# EAGLE design tx (EAGLE 9.2.2)
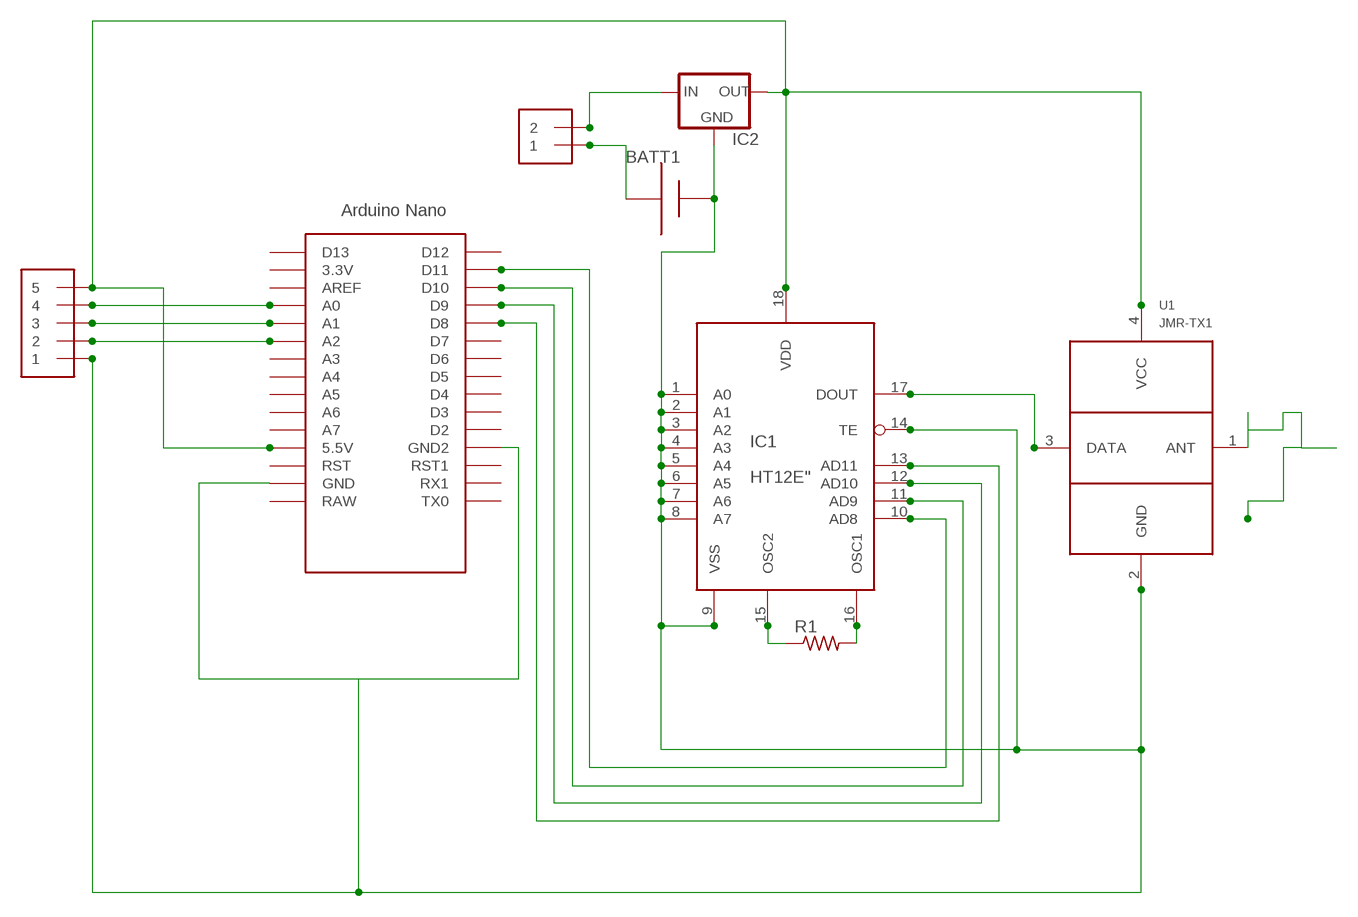
[diagram p0: schematic, sheet 1]

## Parts
BATT1  AAA  [12BH412]
IC1  HT12E"  [18-DIP-A]
IC2  78MXXL  [78MXXL]
J1  1X5  [1X05-3.5MM]
J2  1X2-3.5MM  [1X2-3.5MM]
R1  R-US_0207/9  [0207/9]
U1  JMR-TX1  [JMR-TX1]
U$2  NANO  [NANO]

## Nets
GND: BATT1.+ IC1.1(A0) IC1.2(A1) IC1.3(A2) IC1.4(A3) IC1.5(A4) IC1.6(A5) IC1.7(A6) IC1.8(A7) IC1.9(VSS) IC1.14(TE) IC2.GND J1.1 U1.2(GND) U$2.GND U$2.GND1(GND2)
N$1: IC1.15(OSC2) R1.1
N$2: IC2.IN J2.2
N$3: BATT1.- J2.1
N$4: IC1.16(OSC1) R1.2
N$5: IC1.13(AD11) U$2.D8
N$6: IC1.17(DOUT) U1.3(DATA)
N$7: IC1.12(AD10) U$2.D9
N$8: IC1.11(AD9) U$2.D10
N$9: IC1.10(AD8) U$2.D11
N$10: U1.1(ANT)
N$11: J1.4 U$2.A0
N$12: J1.3 U$2.A1
N$13: J1.2 U$2.A2
VCC: IC1.18(VDD) IC2.OUT J1.5 U1.4(VCC) U$2.5V(5.5V)
Unconnected: U$2.3.3V U$2.A3 U$2.A4 U$2.A5 U$2.A6 U$2.A7 U$2.AREF U$2.D2 U$2.D3 U$2.D4 U$2.D5 U$2.D6 U$2.D7 U$2.D12 U$2.D13 U$2.ICSP1 U$2.ICSP2 U$2.ICSP3 U$2.ICSP4 U$2.ICSP5 U$2.ICSP6 U$2.RAW U$2.RST U$2.RST1 U$2.RX1 U$2.TX0

## Library data of the parts
BATT1 = adafruit:AAA: AAA PC pin holder Mouser part #12BH412 - but pretty much any 1x AAA battery holder should be the same http://www.ladyada.net/library/pcb/eaglelibrary.html
IC1 = holtek:HT12E: transmitter = encoder ic
IC2 = v-reg:78MXXL: VOLTAGE REGULATOR
J1 = adafruit:1X5
J2 = adafruit:1X2: 3.5mm Terminal block http://www.ladyada.net/library/pcb/eaglelibrary.html
R1 = adafruit:R-US_: RESISTOR, American symbol
U1 = JMR_RF_Lib:JMR-TX1
U$2 = Arduino-clone:NANO: Arduino Nano

## Net classes
0 default: width 0.305 mm, drill 0.508 mm, clearance 0.381 mm

## Board
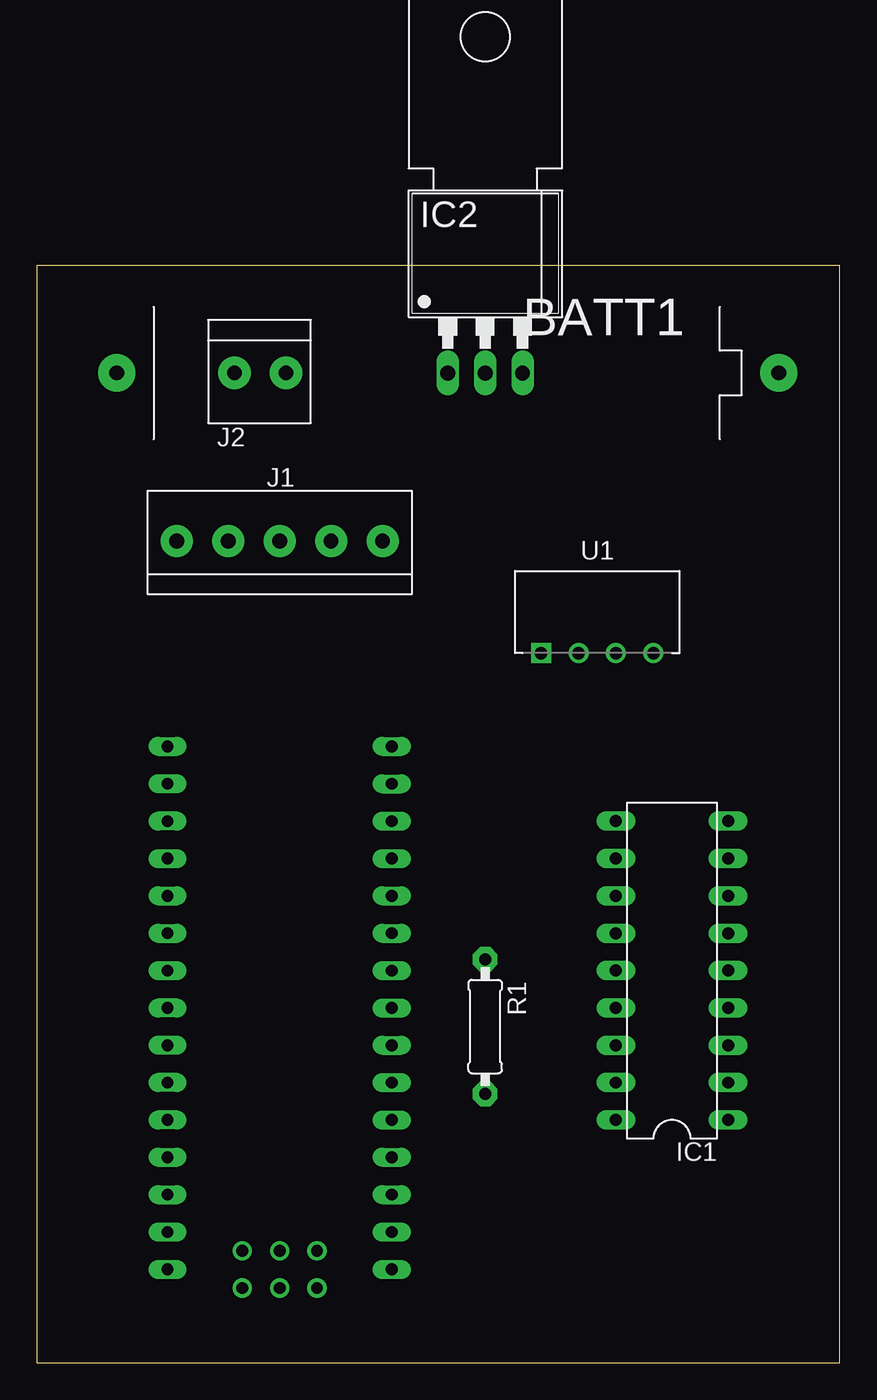
[diagram p1: board, top side]
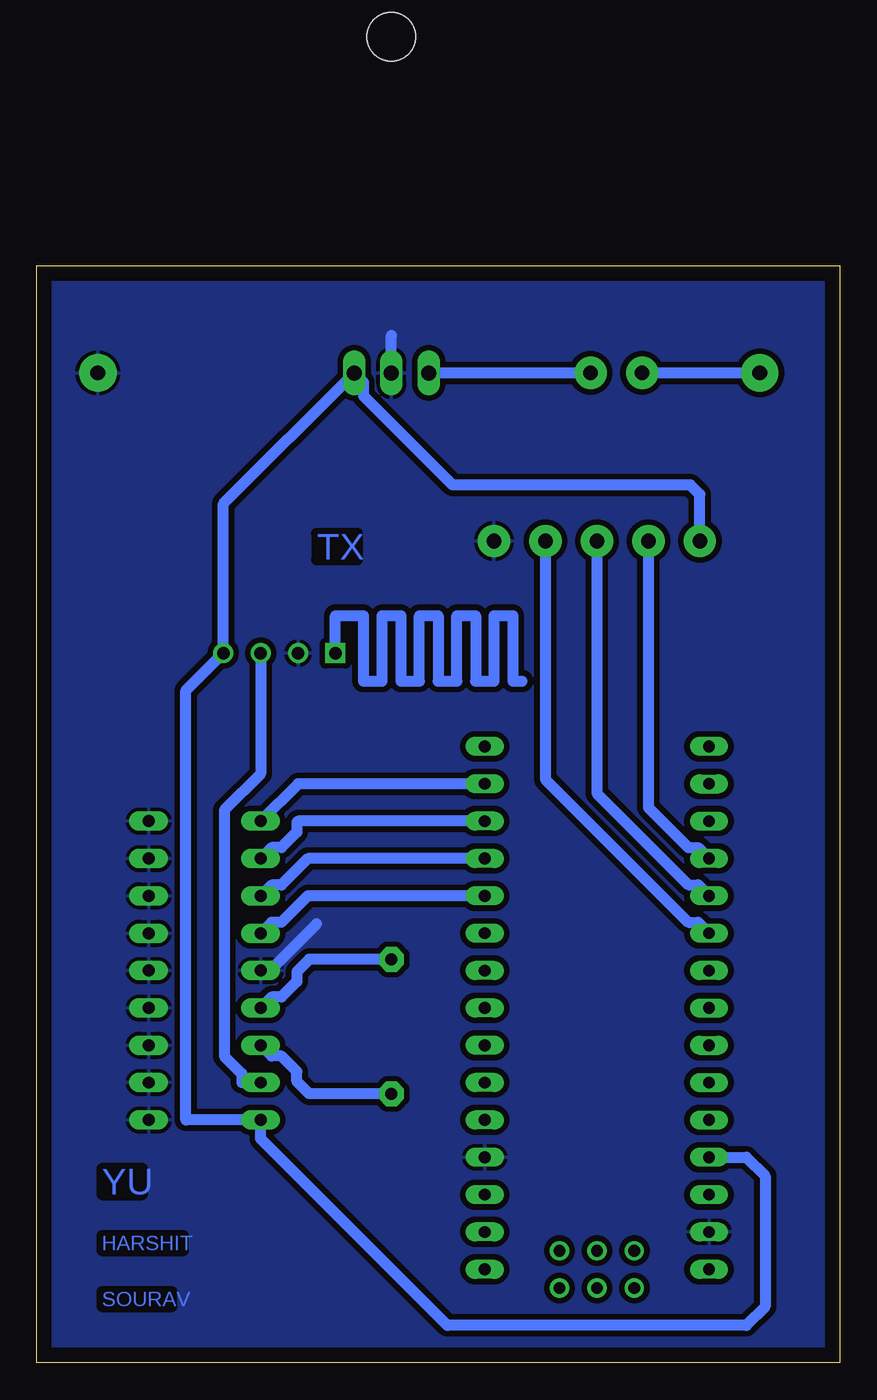
[diagram p2: board, bottom side, seen from below]

Size 54.59 x 74.6 mm. Coordinates in mm from the lower left corner, seen from the top.
Outline: 0,0 54.59,0 54.59,74.6 0,74.6 0,0
Copper layers (1*16): Top 0.035mm / dielectric 1.5mm / Bottom 0.035mm
Design rules "default": minimum track width 6mil, minimum drill 0.35mm, track to track 6mil, track to pad 6mil, pad to pad 6mil, via to via 6mil, smd to smd 6mil, copper to edge 40mil, drill to drill 6mil, minimum pad ring 10mil, minimum via ring 8mil, stop-mask expansion 4mil, vias tented up to drill 0mil, thermal gap 10mil

### Footprints (pad centres in the part's own frame; a part is rotated, then mirrored left to right if it is on the bottom)
12BH412 = drill 1 pad 2.54: + 22.5,0; - -22.5,0
18-DIP-A = drill 0.813 long: 1 -10.16,-3.81; 2 -7.62,-3.81; 3 -5.08,-3.81; 4 -2.54,-3.81; 5 0,-3.81; 6 2.54,-3.81; 7 5.08,-3.81; 8 7.62,-3.81; 9 10.16,-3.81; 10 10.16,3.81; 11 7.62,3.81; 12 5.08,3.81; 13 2.54,3.81; 14 0,3.81; 15 -2.54,3.81; 16 -5.08,3.81; 17 -7.62,3.81; 18 -10.16,3.81
78MXXL = drill 1.016 long: GND 0,-5.08; IN -2.54,-5.08; OUT 2.54,-5.08 | hole 3.302: 0,17.78
1X05-3.5MM = drill 1 pad 2.184: 1 7,0; 2 3.5,0; 3 0,0; 4 -3.5,0; 5 -7,0
1X2-3.5MM = drill 1 pad 2.184: 1 1.8,0; 2 -1.7,0
0207/9 = drill 0.813 pad 1.676 octagon: 1 -4.572,0; 2 4.572,0
JMR-TX1 = drill 0.85 square: 1 -3.81,0 | drill 0.85: 2 -1.27,0; 3 1.27,0; 4 3.81,0
NANO = drill 0.8 long: 3.3V -10.16,24.13; 5V -10.16,-1.27; A0 -10.16,19.05; A1 -10.16,16.51; A2 -10.16,13.97; A3 -10.16,11.43; A4 -10.16,8.89; A5 -10.16,6.35; A6 -10.16,3.81; A7 -10.16,1.27; AREF -10.16,21.59; D2 5.08,1.27; D3 5.08,3.81; D4 5.08,6.35; D5 5.08,8.89; D6 5.08,11.43; D7 5.08,13.97; D8 5.08,16.51; D9 5.08,19.05; D10 5.08,21.59; D11 5.08,24.13; D12 5.08,26.67; D13 -10.16,26.67; GND -10.16,-6.35; GND1 5.08,-1.27; RAW -10.16,-8.89; RST -10.16,-3.81; RST1 5.08,-3.81; RX1 5.08,-6.35; TX0 5.08,-8.89 | drill 0.8: ICSP1 -5.08,-10.16; ICSP2 -5.08,-7.62; ICSP3 -2.54,-10.16; ICSP4 -2.54,-7.62; ICSP5 0,-10.16; ICSP6 0,-7.62

### Placement (x,y rotation side)
BATT1  27.94,67.31 0 top
IC1  43.18,26.67 90 top
IC2  30.48,72.39 0 top
J1  16.51,55.88 0 top
J2  15.24,67.31 180 top
R1  30.48,22.86 270 top
U1  38.1,48.26 0 top
U$2  19.05,15.24 0 top

### Tracks (layer width: path | path; a pad name or v marks a point on that pad's centre or on a via)
GND
  Bottom 0.762: IC2.GND 30.48,69.85 | IC1.14 38.73,26.67 35.56,29.84
  pour Bottom: -2.54,74.93 -2.54,-1.27 -1.27,-2.54 58.42,-2.54 58.42,73.66 57.15,74.93 54.61,77.47 -1.27,77.47 -2.54,76.2
N$1
  Bottom 0.762: R1.1 36.07,27.43 36.91,26.59 36.91,25.92 37.96,24.87 38.63,24.87 IC1.15
N$2
  Bottom 0.762: J2.2 IC2.IN
N$3
  Bottom 0.762: BATT1.- J2.1
N$4
  Bottom 0.762: R1.2 36.07,18.29 36.91,19.13 36.91,19.8 37.96,20.85 38.63,20.85 IC1.16
N$5
  Bottom 0.762: IC1.13 38.63,29.95 37.96,29.95 36.16,31.75 U$2.D8
N$6
  Bottom 0.762: U1.3 39.37,40.04 41.83,37.58 41.83,20.84 40.64,19.65 40.64,19.05 IC1.17
N$7
  Bottom 0.762: IC1.12 38.63,32.49 37.96,32.49 36.16,34.29 U$2.D9
N$8
  Bottom 0.762: U$2.D10 36.83,36.83 36.91,36.75 36.91,36.08 37.96,35.03 38.63,35.03 IC1.11
N$9
  Bottom 0.762: U$2.D11 36.83,39.37 IC1.10
N$10
  Bottom 0.762: U1.1 34.29,50.8 32.38,50.8 32.38,46.35 31.11,46.35 31.11,50.8 29.84,50.8 29.84,46.35 28.57,46.35 28.57,50.8 27.3,50.8 27.3,46.35 26.04,46.35 26.04,50.8 24.77,50.8 24.77,46.35 23.5,46.35 23.5,50.8 22.23,50.8 22.23,46.35 21.59,46.35
N$11
  Bottom 0.762: U$2.A0 9.63,35.03 10.29,35.03 13.01,37.76 J1.4
N$12
  Bottom 0.762: U$2.A1 9.63,32.49 10.29,32.49 16.51,38.72 J1.3
N$13
  Bottom 0.762: U$2.A2 9.63,29.95 10.29,29.95 20.01,39.67 J1.2
VCC
  Bottom 0.762: U$2.5V 6.35,13.97 5.08,12.7 5.08,3.81 6.35,2.54 26.67,2.54 39.37,15.24 IC1.18 44.45,16.51 44.45,45.72 U1.4 41.91,58.42 IC2.OUT 32.38,66.67 32.38,65.76 26.32,59.69 10.16,59.69 9.51,59.04 J1.5

### Text on the board
Bottom: TX | YU | HARSHIT | SOURAV